# Altium schematic sheet develer_2L_A4.SchDoc: TITLE
size A4; Author: AUTHOR; Organization: Develer s.r.l.; Address1: via Mugellese 1/A; Address2: 50019 Campi Bisenzio; Address3: Firenze; Address4: ITALY; Revision: A; SheetNumber: 1; SheetTotal: 1; Hw_rev: R1
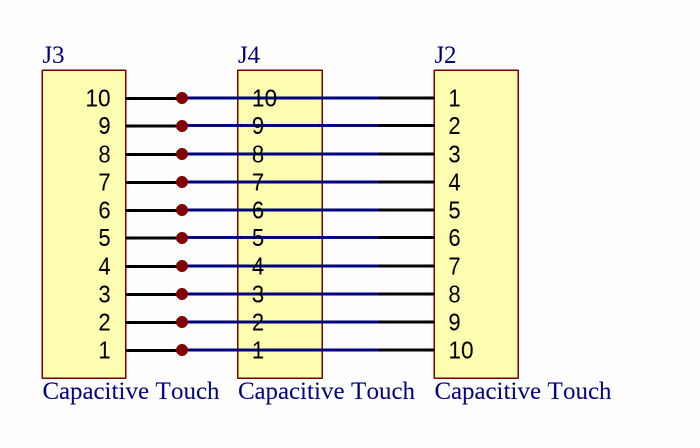
[diagram p0: develer_2L_A4.SchDoc]

## Parts
J2  Capacitive Touch  [fcc-zif_10pin_0.5mm]
J3  Capacitive Touch  [fcc-zif_10pin_0.5mm]
J4  Capacitive Touch  [fcc-zif_10pin_0.5mm]

## Nets
NetJ2_1: J2.1 J3.10 J4.10
NetJ2_2: J2.2 J3.9 J4.9
NetJ2_3: J2.3 J3.8 J4.8
NetJ2_4: J2.4 J3.7 J4.7
NetJ2_5: J2.5 J3.6 J4.6
NetJ2_6: J2.6 J3.5 J4.5
NetJ2_7: J2.7 J3.4 J4.4
NetJ2_8: J2.8 J3.3 J4.3
NetJ2_9: J2.9 J3.2 J4.2
NetJ2_10: J2.10 J3.1 J4.1

## Notes on the sheet
- Title:
- Project:
- Status:
- Author:
- License:
- Rev:
- Size:
- A4
- File:
- Date:
- Time:
- Sheet
- of

## Library data of the parts
J2-J4 = Header 10: 10-pin, 0.5mm, SMT, ZIF, Horizontal, Top Contact; LatestRevisionDate: 17-Jul-2002; LatestRevisionNote: Re-released for DXP Platform.; Publisher: Altium Limited